# Altium schematic sheet 51-2001-01-16_04 Power Module Schematic.SchDoc
size 431 x 279 mm; Organization: ORGANIZATION; Address1: ADDRESS 1; Address2: ADDRESS 2; Address3: ADDRESS 3; Address4: ADDRESS 4; Revision: -; SheetNumber: 4; SheetTotal: 4; ENG_APP_DATE: --/--/--; DSN_APP_DATE: --/--/--; CHK_APP_DATE: --/--/--
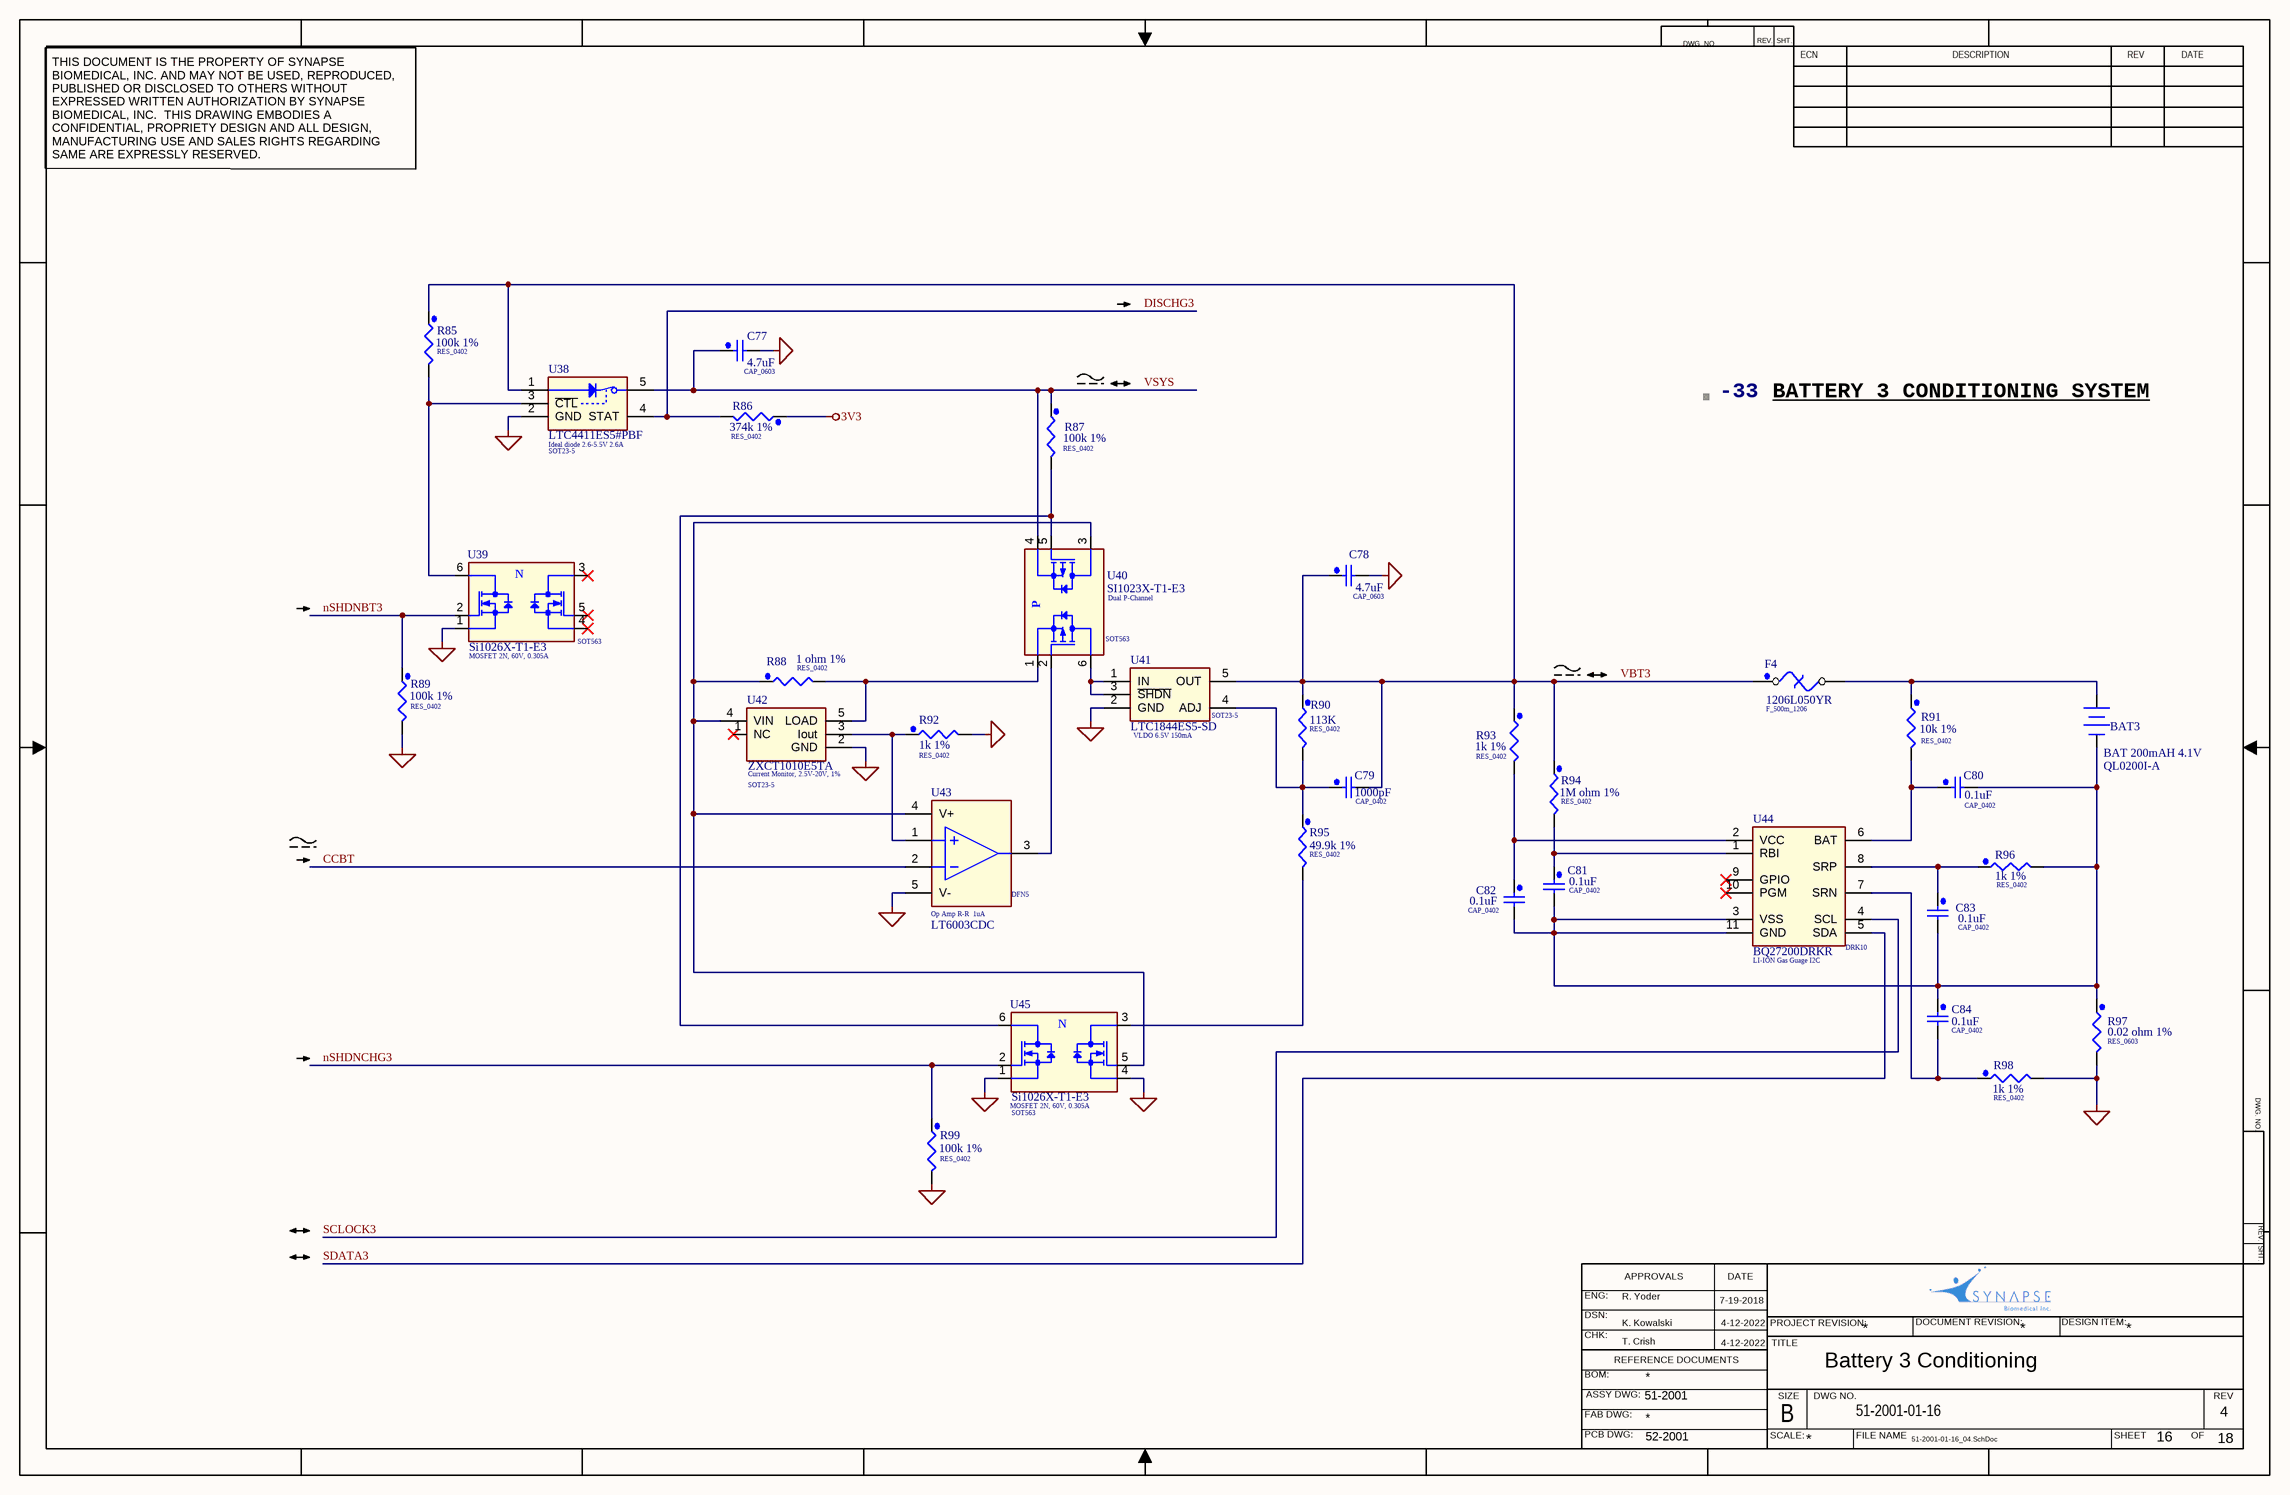
[diagram p0: 51-2001-01-16_04 Power Module Schematic.SchDoc]

## Parts
-33  XDESCRIPTION: BATTERY 3 CONDITIONING SYSTEM  (hidden comment: BOM_S1)  (graphical)
BAT3  BAT 200mAH 4.1V  [QL0200I-A]  (no BOM)
C77  value 4.7uF  [CAP_0603]  (hidden comment: C_4u7_X5R_10_0603_10%)
C78  value 4.7uF  [CAP_0603]  (hidden comment: C_4u7_X5R_10_0603_10%)
C79  value 1000pF  [CAP_0402]  (hidden comment: C_1n_C0G_50_0402_5%)
C80  value 0.1uF  [CAP_0402]  (hidden comment: C_100n_X7R_16_0402_10%)
C81  value 0.1uF  [CAP_0402]  (hidden comment: C_100n_X7R_16_0402_10%)
C82  value 0.1uF  [CAP_0402]  (hidden comment: C_100n_X7R_16_0402_10%)
C83  value 0.1uF  [CAP_0402]  (hidden comment: C_100n_X7R_16_0402_10%)
C84  value 0.1uF  [CAP_0402]  (hidden comment: C_100n_X7R_16_0402_10%)
F4  F_500m_1206  [FUSE_1206]
R85  value 100k 1%  [RES_0402]  (hidden comment: R_100k_0402)
R86  value 374k 1%  [RES_0402]  (hidden comment: R_374k_0402)
R87  value 100k 1%  [RES_0402]  (hidden comment: R_100k_0402)
R88  value 1 ohm 1%  [RES_0402]  (hidden comment: R_1_0402)
R89  value 100k 1%  [RES_0402]  (hidden comment: R_100k_0402)
R90  value 113K  [RES_0402]  (hidden comment: R_113k_0402)
R91  value 10k 1%  [RES_0402]  (hidden comment: R_10k_0402)
R92  value 1k 1%  [RES_0402]  (hidden comment: R_1k_0402)
R93  value 1k 1%  [RES_0402]  (hidden comment: R_1k_0402)
R94  value 1M ohm 1%  [RES_0402]  (hidden comment: RES_0402)
R95  value 49.9k 1%  [RES_0402]  (hidden comment: R_49k9_0402)
R96  value 1k 1%  [RES_0402]  (hidden comment: R_1k_0402)
R97  value 0.02 ohm 1%  [RES_0603]  (hidden comment: R_20m_0603)
R98  value 1k 1%  [RES_0402]  (hidden comment: R_1k_0402)
R99  value 100k 1%  [RES_0402]  (hidden comment: R_100k_0402)
U38  Ideal diode 2.6-5.5V 2.6A  MPN: LTC4411ES5#PBF  [SOT23-5]
U39  MOSFET 2N, 60V, 0.305A  PackageDescription: SOT563  [SOT-563]
U40  Dual P-Channel  PackageDescription: SOT563  [SOT-563]
U41  VLDO 6.5V 150mA  [SOT23-5]
U42  Current Monitor, 2.5V-20V, 1%  [SOT23-5]
U43  Op Amp R-R  1uA  PackageDescription: DFN5  [DFN4]
U44  LI-ION Gas Guage I2C  PackageDescription: DRK10  [QFN10]
U45  MOSFET 2N, 60V, 0.305A  PackageDescription: SOT563  [SOT-563]

## Nets
3V3: R86.1
GND: C77.2 C78.2 R89.2 R92.2 R97.2 R98.2 U38.2(GND) U39.1(S1) U41.2(GND) U42.2(GND) U43.5(V-) U45.1(S1) U45.4(S2)
CCBT: U43.2(-IN)
DISCHG3: R86.2 U38.4(STAT)
nSHDNBT3: R89.1 U39.2(G1)
nSHDNCHG3: R99.1 U45.2(G1)
SCLOCK3: U44.4(SCL)
SDATA3: U44.5(SDA)
VBT3: C78.1 C79.2 F4.1 R85.1 R90.1 R93.1 R94.1 U38.1(IN) U41.5(OUT)
VSYS: C77.1 R87.1 U38.5(OUT) U40.4(S2)
NetBAT3_1: BAT3.1(+) F4.2 R91.1
NetBAT3_2: BAT3.2(-) C80.2 C81.2 C82.2 C83.2 C84.1 R96.2 R97.1 U44.3(VSS) U44.11(GND)
NetC79_1: C79.1 R90.2 R95.1 U41.4(ADJ)
NetC80_1: C80.1 R91.2 U44.6(BAT)
NetC81_1: C81.1 R94.2 U44.1(RBI)
NetC82_1: C82.1 R93.2 U44.2(VCC)
NetC83_1: C83.1 R96.1 U44.8(SRP)
NetC84_2: C84.2 R98.1 U44.7(SRN)
NetR85_2: R85.2 U38.3(~{CTL}) U39.6(D1)
NetR87_2: R87.2 U40.5(G2) U45.6(D1)
NetR88_1: R88.1 U40.3(D2) U42.4(VIN) U43.4(V+) U45.5(G2)
NetR88_2: R88.2 U40.1(S1) U42.5(LOAD)
NetR92_1: R92.1 U42.3(Iout) U43.1(+IN)
NetR95_2: R95.2 U45.3(D2)
NetU40_2: U40.2(G1) U43.3(OUT_A)
NetU40_6: U40.6(D1) U41.1(IN) U41.3(~{SHDN})

Not connected (* = marked no-connect by the designer): R99 2; U39 3(D2)* 4(S2)* 5(G2)*; U42 1(NC)*; U44 9(GPIO)* 10(PGM)*

## Notes on the sheet
- DWG. NO.
- REV.
- SHT.
- ECN
- DESCRIPTION
- REV
- DATE
- THIS DOCUMENT IS THE PROPERTY OF SYNAPSE BIOMEDICAL, INC. AND MAY NOT BE USED, REPRODUCED, PUBLISHED OR DISCLOSED TO OTHERS WITHOUT EXPRESSED WRITTEN AUTHORIZATION BY SYNAPSE BIOMEDICAL, INC.  THIS DRAWING EMBODIES A CONFIDENTIAL, PROPRIETY DESIGN AND ALL DESIGN, MANUFACTURING USE AND SALES RIGHTS REGARDING SAME ARE EXPRESSLY RESERVED.
- ENG:
- R. Yoder
- APPROVALS
- 7-19-2018
- DSN:
- CHK:
- REFERENCE DOCUMENTS
- K. Kowalski
- T. Crish
- 4-12-2022
- PROJECT REVISION:
- TITLE
- Battery 3 Conditioning
- *
- DOCUMENT REVISION:
- DESIGN ITEM:
- BOM:
- FAB DWG:
- PCB DWG:
- ASSY DWG:
- 51-2001
- SCALE:
- SIZE
- B
- DWG NO.
- 51-2001-01-16
- FILE NAME
- SHEET
- OF
- 4
- 52-2001
- 51-2001-01-16_04.SchDoc
- 16
- 18
- (in symbol SI1023X-T1-E3) P
- (in symbol Si1026X-T1-E3) N

## Library data of the parts
-33 = BOM_S1: BOM item small graphic
BAT3 = QL0200I-A: Li-ion battery 200mAH 4.1V; MFR: Quallion; Value: 200mAH 4.1V; Supplier 1: Quallion; Supplier Part Number 1: QL0200I-A; MPN: QL0200I-A
C77 C78 = LMK107BJ475KA-T: 4.7uF, 10V, X5R, 10%, 0603, RoHS; MFR: Murata Electronics North America; MPN: GRM185R61A475KE11D; SBI: 53-0076; PackageDescription: CAP_0603; Supplier 1: Digi-Key; Supplier Part Number 1: 490-11988-6-ND
C79 = GRM1555C1H102JA01D: 1000pF, 50V, C0G, 5%, 0402, RoHS; MFR: Murata; SBI: 53-0041-2; PackageDescription: CAP_0402; Supplier 1: Digi-Key; Supplier Part Number 1: 490-3244-1-ND; MPN: GRM1555C1H102JA01D
C80-C84 = GRM155R71C104KA88D: 0.1uF, 16V, X7R, 0402, RoHS; MFR: Murata; SBI: 53-0040-1; PackageDescription: CAP_0402; Supplier 1: Digi-Key; Supplier Part Number 1: 490-3261-2-ND; MPN: GRM155R71C104KA88D
F4 = 1206L050YR: PTC Resettable, 500mA, 0.4 ohm,  6V, 1206, RoHS; MFR: Littelfuse; SBI: 54-0113; PackageDescription: F_500m_1206; Supplier 1: Digi-Key; Supplier Part Number 1: F2112CT-ND; Value: 500mA; MPN: 1206L050YR
R85 R87 R89 R99 = MCR01MZPF1003: 100k ohm, 1%, 1/16W, smd, 0402, RoHS; MFR: Vishay Dale; MPN: CRCW0402100KFKED; SBI: 53-0049-7; PackageDescription: RES_0402; Supplier 1: Digi-Key; Supplier Part Number 1: 541-100KLDKR-ND
R86 = CRCW0402374KFKED: 374k ohm, 1%, 1/16W, 0402,RoHS; MFR: Vishay Dale; SBI: 53-0049-25; PackageDescription: RES_0402; Supplier 1: Digi-Key; Supplier Part Number 1: 541-374KLDKR-ND; MPN: CRCW0402374KFKED
R88 = CRCW04021R00FNED: 1.0 ohm, 1%, 1/16W, 0402, RoHS; MFR: Vishay Dale; SBI: 53-0049-32; PackageDescription: RES_0402; Supplier 1: Digi-Key; Supplier Part Number 1: 541-1.00LLCT-ND; MPN: CRCW04021R00FNED
R90 = ERJ-2RKF1133X: 113k ohm, 1%, 1/16W, 0402, RoHS; MFR: Vishay Dale; MPN: CRCW0402113KFKED; SBI: 53-0049-33; PackageDescription: RES_0402; Supplier 1: Digi-Key; Supplier Part Number 1: 541-113KLDKR-ND
R91 = MCR01MZPF1002: 10.0k ohm, 1%, 1/16W, smd, 0402, RoHS; MFR: Vishay Dale; MPN: CRCW040210K0FKED; PackageDescription: RES_0402; Supplier 1: Digi-Key; Supplier Part Number 1: 541-10.0KLDKR-ND
R92 R93 R96 R98 = MCR01MZPF1001: 1.0k ohm 1% 1/16W smd 0402 RoHS; MFR: Vishay Dale; MPN: CRCW04021K00FKED; SBI: 53-0049-4; PackageDescription: RES_0402; Supplier 1: Digi-Key; Supplier Part Number 1: 541-1.00KLDKR-ND
R94 = MCR01MZPF1004: 1M ohm, 1/16W, 1%, 0402, RoHS; MFR: Vishay Dale; MPN: CRCW04021M00FKED; SBI: 53-0095; PackageDescription: RES_0402; Supplier 1: Digi-Key; Supplier Part Number 1: 541-1.00MLDKR-ND
R95 = MCR01MZPF4992: 49.9k ohm, 1%, 1/16W, 0402, RoHS; MFR: Vishay Dale; MPN: CRCW040249K9FKED; SBI: 53-009-2; PackageDescription: RES_0402; Supplier 1: Digi-Key; Supplier Part Number 1: 541-49.9KLDKR-ND
R97 = WSL0603R0200FEA: 0.02 ohm, 1%, 1/10W, 0603, RoHS; MFR: Vishay Dale; SBI: 53-0087; PackageDescription: RES_0603; Supplier 1: Digi-Key; Supplier Part Number 1: WSLJ-.02DKR-ND; MPN: WSL0603R0200FEA
U38 = LTC4411ES5: Ideal diode, 2.6-5.5V, 2.6A, SOT23-5, RoHS; MFR: Linear Technology; SBI: 54-0101; Supplier 1: Digi-Key; Supplier Part Number 1: LTC4411ES5#TRMPBFDKR-ND; PackageDescription: SOT23-5
U39 U45 = Si1026X-T1-E3: MOSFET 2N, 60V, 0.305A, RoHS; MFR: Vishay Siliconix; Value: 500mA; SBI: 54-0102; Supplier 1: Digi-Key; Supplier Part Number 1: SI1026X-T1-E3CT-ND; MPN: Si1026X-T1-E3
U40 = SI1023X-T1-E3: Dual P-Channel Mosfet, SOT563, RoHS; MFR: Vishay Siliconix; Value: -350mA; SBI: 54-0103; Supplier 1: Digi-Key; Supplier Part Number 1: SI1023X-T1-GE3CT-ND; MPN: SI1023X-T1-E3
U41 = LTC1844ES5-SD: VLDO, 150mA, SOT23-5, RoHS; MFR: Linear Technology; SBI: 54-0104; Supplier 1: Digi-Key; Supplier Part Number 1: LTC1844ES5-SD#TRMPBFDKR-ND; PackageDescription: SOT23-5; Value: 150mA; MPN: LTC1844ES5-SD
U42 = ZXCT1010E5TA: Current Monitor, 2.5V-20V, 1%, RoHS; MFR: Diodes Incorporated; SBI: 54-0052; ComponentLink1URL: Q:\00\04\00-04-3500 Zetex ZXCT1010.pdf; ComponentNNPS_PN: 00-04-3500; PackageDescription: SOT23-5; Supplier 1: Digi-Key; Supplier Part Number 1: ZXCT1010DKR-ND; Value: ZXCT1010; MPN: ZXCT1010E5TA
U43 = LT6003CDC: Op Amp, R-R, 1uA, RoHS; MFR: Linear Technology; SBI: 54-0105; Supplier 1: Digi-Key; Supplier Part Number 1: LT6003CDC#TRMPBFDKR-ND; MPN: LT6003CDC
U44 = BQ27200DRKR: LI-ION Gas Guage, I2C, QFN10, RoHS; MFR: Texas Instruments; SBI: 54-0106; Supplier 1: Digi-Key; Supplier Part Number 1: 296-17521-6-ND; MPN: BQ27200DRKR